# Altium schematic sheet MainSheet.SchDoc
size A; SheetNumber: 1; SheetTotal: 6
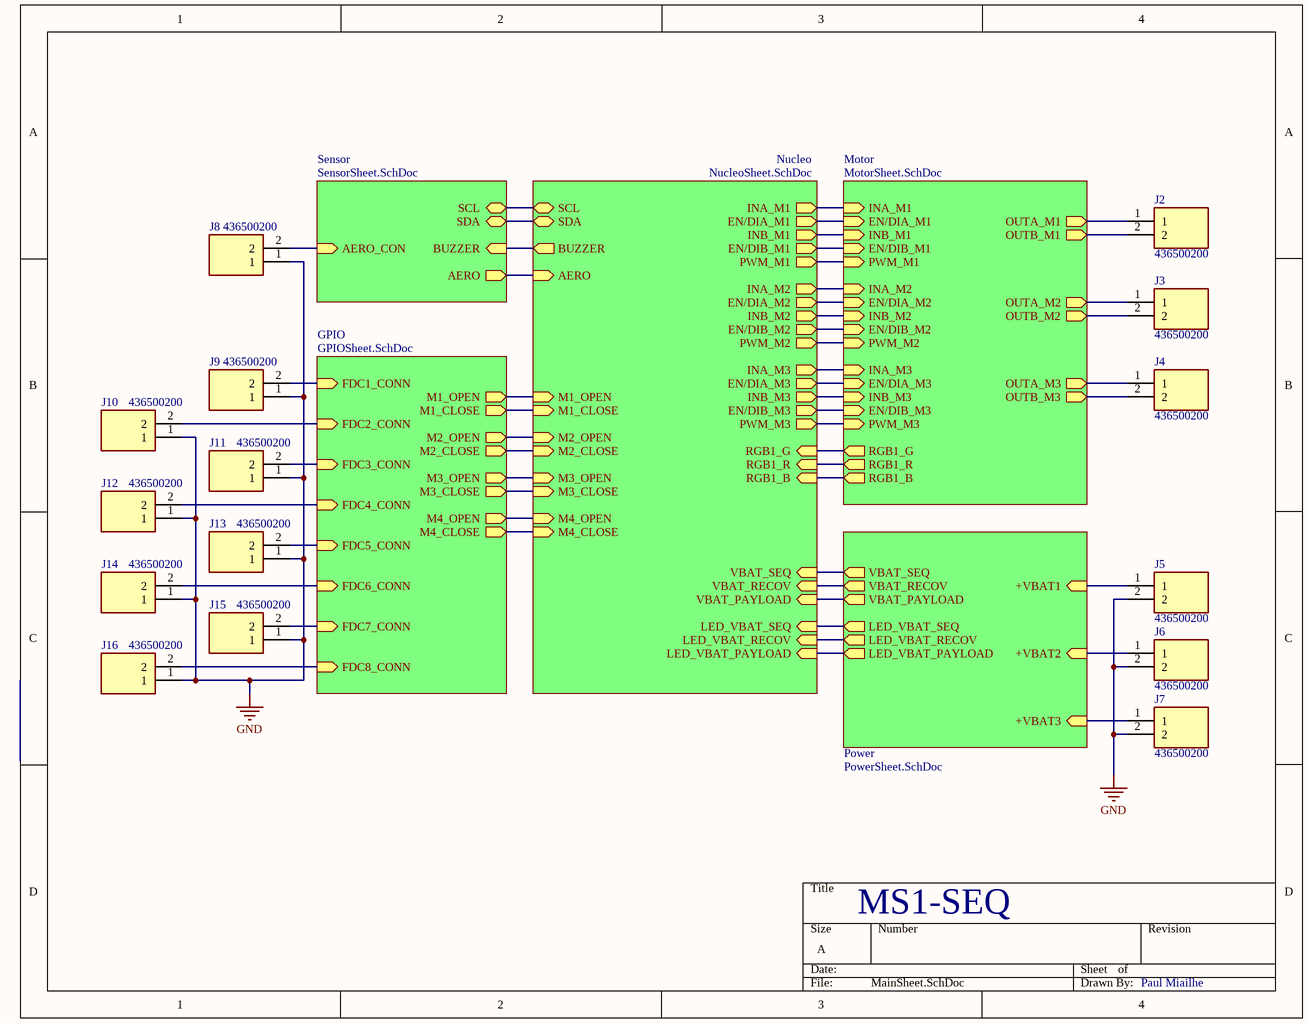
[diagram p0: MainSheet.SchDoc]

## Parts
J2  436500200  [MOLEX_436500200]
J3  436500200  [MOLEX_436500200]
J4  436500200  [MOLEX_436500200]
J5  436500200  [MOLEX_436500200]
J6  436500200  [MOLEX_436500200]
J7  436500200  [MOLEX_436500200]
J8  436500200  [MOLEX_436500200]
J9  436500200  [MOLEX_436500200]
J10  436500200  [MOLEX_436500200]
J11  436500200  [MOLEX_436500200]
J12  436500200  [MOLEX_436500200]
J13  436500200  [MOLEX_436500200]
J14  436500200  [MOLEX_436500200]
J15  436500200  [MOLEX_436500200]
J16  436500200  [MOLEX_436500200]

## Sub-sheets
GPIO = GPIOSheet.SchDoc: M1_OPEN (out), M1_CLOSE (out), M2_OPEN (out), M2_CLOSE (out), M3_OPEN (out), M3_CLOSE (out), FDC1_CONN (in), FDC2_CONN (in), FDC3_CONN (in), FDC4_CONN (in), FDC5_CONN (in), FDC6_CONN (in), FDC7_CONN (in), FDC8_CONN (in), M4_CLOSE (out), M4_OPEN (out)
Motor = MotorSheet.SchDoc: INA_M1 (in), EN/DIA_M1 (in), INB_M1 (in), EN/DIB_M1 (in), PWM_M1 (in), INA_M2 (in), EN/DIA_M2 (in), INB_M2 (in), EN/DIB_M2 (in), PWM_M2 (in), INA_M3 (in), EN/DIA_M3 (in), INB_M3 (in), EN/DIB_M3 (in), PWM_M3 (in), RGB1_G (out), RGB1_R (out), RGB1_B (out), OUTA_M1 (out), OUTB_M1 (out), OUTA_M2 (out), OUTB_M2 (out), OUTA_M3 (out), OUTB_M3 (out)
Nucleo = NucleoSheet.SchDoc: EN/DIA_M1 (out), INA_M1 (out), PWM_M1 (out), EN/DIB_M1 (out), INB_M1 (out), INA_M2 (out), EN/DIA_M2 (out), INB_M2 (out), EN/DIB_M2 (out), PWM_M2 (out), INA_M3 (out), EN/DIA_M3 (out), INB_M3 (out), EN/DIB_M3 (out), PWM_M3 (out), RGB1_G (in), RGB1_R (in), RGB1_B (in), VBAT_SEQ (in), VBAT_RECOV (in), VBAT_PAYLOAD (in), LED_VBAT_SEQ (in), LED_VBAT_RECOV (in), LED_VBAT_PAYLOAD (in), M1_OPEN (in), M1_CLOSE (in), M2_OPEN (in), M2_CLOSE (in), M3_OPEN (in), M3_CLOSE (in), SCL (bidir), SDA (bidir), BUZZER (out), AERO (in), M4_OPEN (in), M4_CLOSE (in)
Power = PowerSheet.SchDoc: VBAT_SEQ (out), VBAT_RECOV (out), VBAT_PAYLOAD (out), LED_VBAT_SEQ (out), LED_VBAT_RECOV (out), LED_VBAT_PAYLOAD (out), +VBAT1 (in), +VBAT2 (in), +VBAT3 (in)
Sensor = SensorSheet.SchDoc: SCL (bidir), SDA (bidir), BUZZER (in), AERO (out), AERO_CON (in)

## Nets
GND: J5.2 J6.2 J7.2 J8.1 J9.1 J10.1 J11.1 J12.1 J13.1 J14.1 J15.1 J16.1
NetJ2_1: J2.1 ; sheet Motor/OUTA_M1
NetJ2_2: J2.2 ; sheet Motor/OUTB_M1
NetJ3_1: J3.1 ; sheet Motor/OUTA_M2
NetJ3_2: J3.2 ; sheet Motor/OUTB_M2
NetJ4_1: J4.1 ; sheet Motor/OUTA_M3
NetJ4_2: J4.2 ; sheet Motor/OUTB_M3
NetJ5_1: J5.1 ; sheet Power/+VBAT1
NetJ6_1: J6.1 ; sheet Power/+VBAT2
NetJ7_1: J7.1 ; sheet Power/+VBAT3
NetJ8_2: J8.2 ; sheet Sensor/AERO_CON
NetJ9_2: J9.2 ; sheet GPIO/FDC1_CONN
NetJ10_2: J10.2 ; sheet GPIO/FDC2_CONN
NetJ11_2: J11.2 ; sheet GPIO/FDC3_CONN
NetJ12_2: J12.2 ; sheet GPIO/FDC4_CONN
NetJ13_2: J13.2 ; sheet GPIO/FDC5_CONN
NetJ14_2: J14.2 ; sheet GPIO/FDC6_CONN
NetJ15_2: J15.2 ; sheet GPIO/FDC7_CONN
NetJ16_2: J16.2 ; sheet GPIO/FDC8_CONN
(unnamed): sheet Motor/INA_M1, sheet Nucleo/INA_M1
(unnamed): sheet Motor/EN/DIA_M1, sheet Nucleo/EN/DIA_M1
(unnamed): sheet Motor/INB_M1, sheet Nucleo/INB_M1
(unnamed): sheet Motor/EN/DIB_M1, sheet Nucleo/EN/DIB_M1
(unnamed): sheet Motor/PWM_M1, sheet Nucleo/PWM_M1
(unnamed): sheet Motor/INA_M2, sheet Nucleo/INA_M2
(unnamed): sheet Motor/EN/DIA_M2, sheet Nucleo/EN/DIA_M2
(unnamed): sheet Motor/INB_M2, sheet Nucleo/INB_M2
(unnamed): sheet Motor/EN/DIB_M2, sheet Nucleo/EN/DIB_M2
(unnamed): sheet Motor/PWM_M2, sheet Nucleo/PWM_M2
(unnamed): sheet Motor/INA_M3, sheet Nucleo/INA_M3
(unnamed): sheet Motor/EN/DIA_M3, sheet Nucleo/EN/DIA_M3
(unnamed): sheet Motor/INB_M3, sheet Nucleo/INB_M3
(unnamed): sheet Motor/EN/DIB_M3, sheet Nucleo/EN/DIB_M3
(unnamed): sheet Motor/PWM_M3, sheet Nucleo/PWM_M3
(unnamed): sheet Motor/RGB1_G, sheet Nucleo/RGB1_G
(unnamed): sheet Motor/RGB1_R, sheet Nucleo/RGB1_R
(unnamed): sheet Motor/RGB1_B, sheet Nucleo/RGB1_B
(unnamed): sheet Power/VBAT_SEQ, sheet Nucleo/VBAT_SEQ
(unnamed): sheet Power/VBAT_RECOV, sheet Nucleo/VBAT_RECOV
(unnamed): sheet Power/VBAT_PAYLOAD, sheet Nucleo/VBAT_PAYLOAD
(unnamed): sheet Power/LED_VBAT_SEQ, sheet Nucleo/LED_VBAT_SEQ
(unnamed): sheet Power/LED_VBAT_RECOV, sheet Nucleo/LED_VBAT_RECOV
(unnamed): sheet Power/LED_VBAT_PAYLOAD, sheet Nucleo/LED_VBAT_PAYLOAD
(unnamed): sheet Nucleo/M1_OPEN, sheet GPIO/M1_OPEN
(unnamed): sheet Nucleo/M1_CLOSE, sheet GPIO/M1_CLOSE
(unnamed): sheet Nucleo/M2_OPEN, sheet GPIO/M2_OPEN
(unnamed): sheet Nucleo/M2_CLOSE, sheet GPIO/M2_CLOSE
(unnamed): sheet Nucleo/M3_OPEN, sheet GPIO/M3_OPEN
(unnamed): sheet Nucleo/M3_CLOSE, sheet GPIO/M3_CLOSE
(unnamed): sheet Nucleo/SCL, sheet Sensor/SCL
(unnamed): sheet Nucleo/SDA, sheet Sensor/SDA
(unnamed): sheet Nucleo/BUZZER, sheet Sensor/BUZZER
(unnamed): sheet Nucleo/AERO, sheet Sensor/AERO
(unnamed): sheet Nucleo/M4_OPEN, sheet GPIO/M4_OPEN
(unnamed): sheet Nucleo/M4_CLOSE, sheet GPIO/M4_CLOSE

## Notes on the sheet
- MS1-SEQ
- Paul Miailhe

## Library data of the parts
J2-J16 = 436500200: MF: {'manufacturer': u'Molex'}; Availability: Unavailable; Price: None; Package: None; Value: *; MP: 436500200